# EAGLE design PowerSupply_5V_v1 (EAGLE 9.6.2)

## Sheet 1 of 3: MAIN
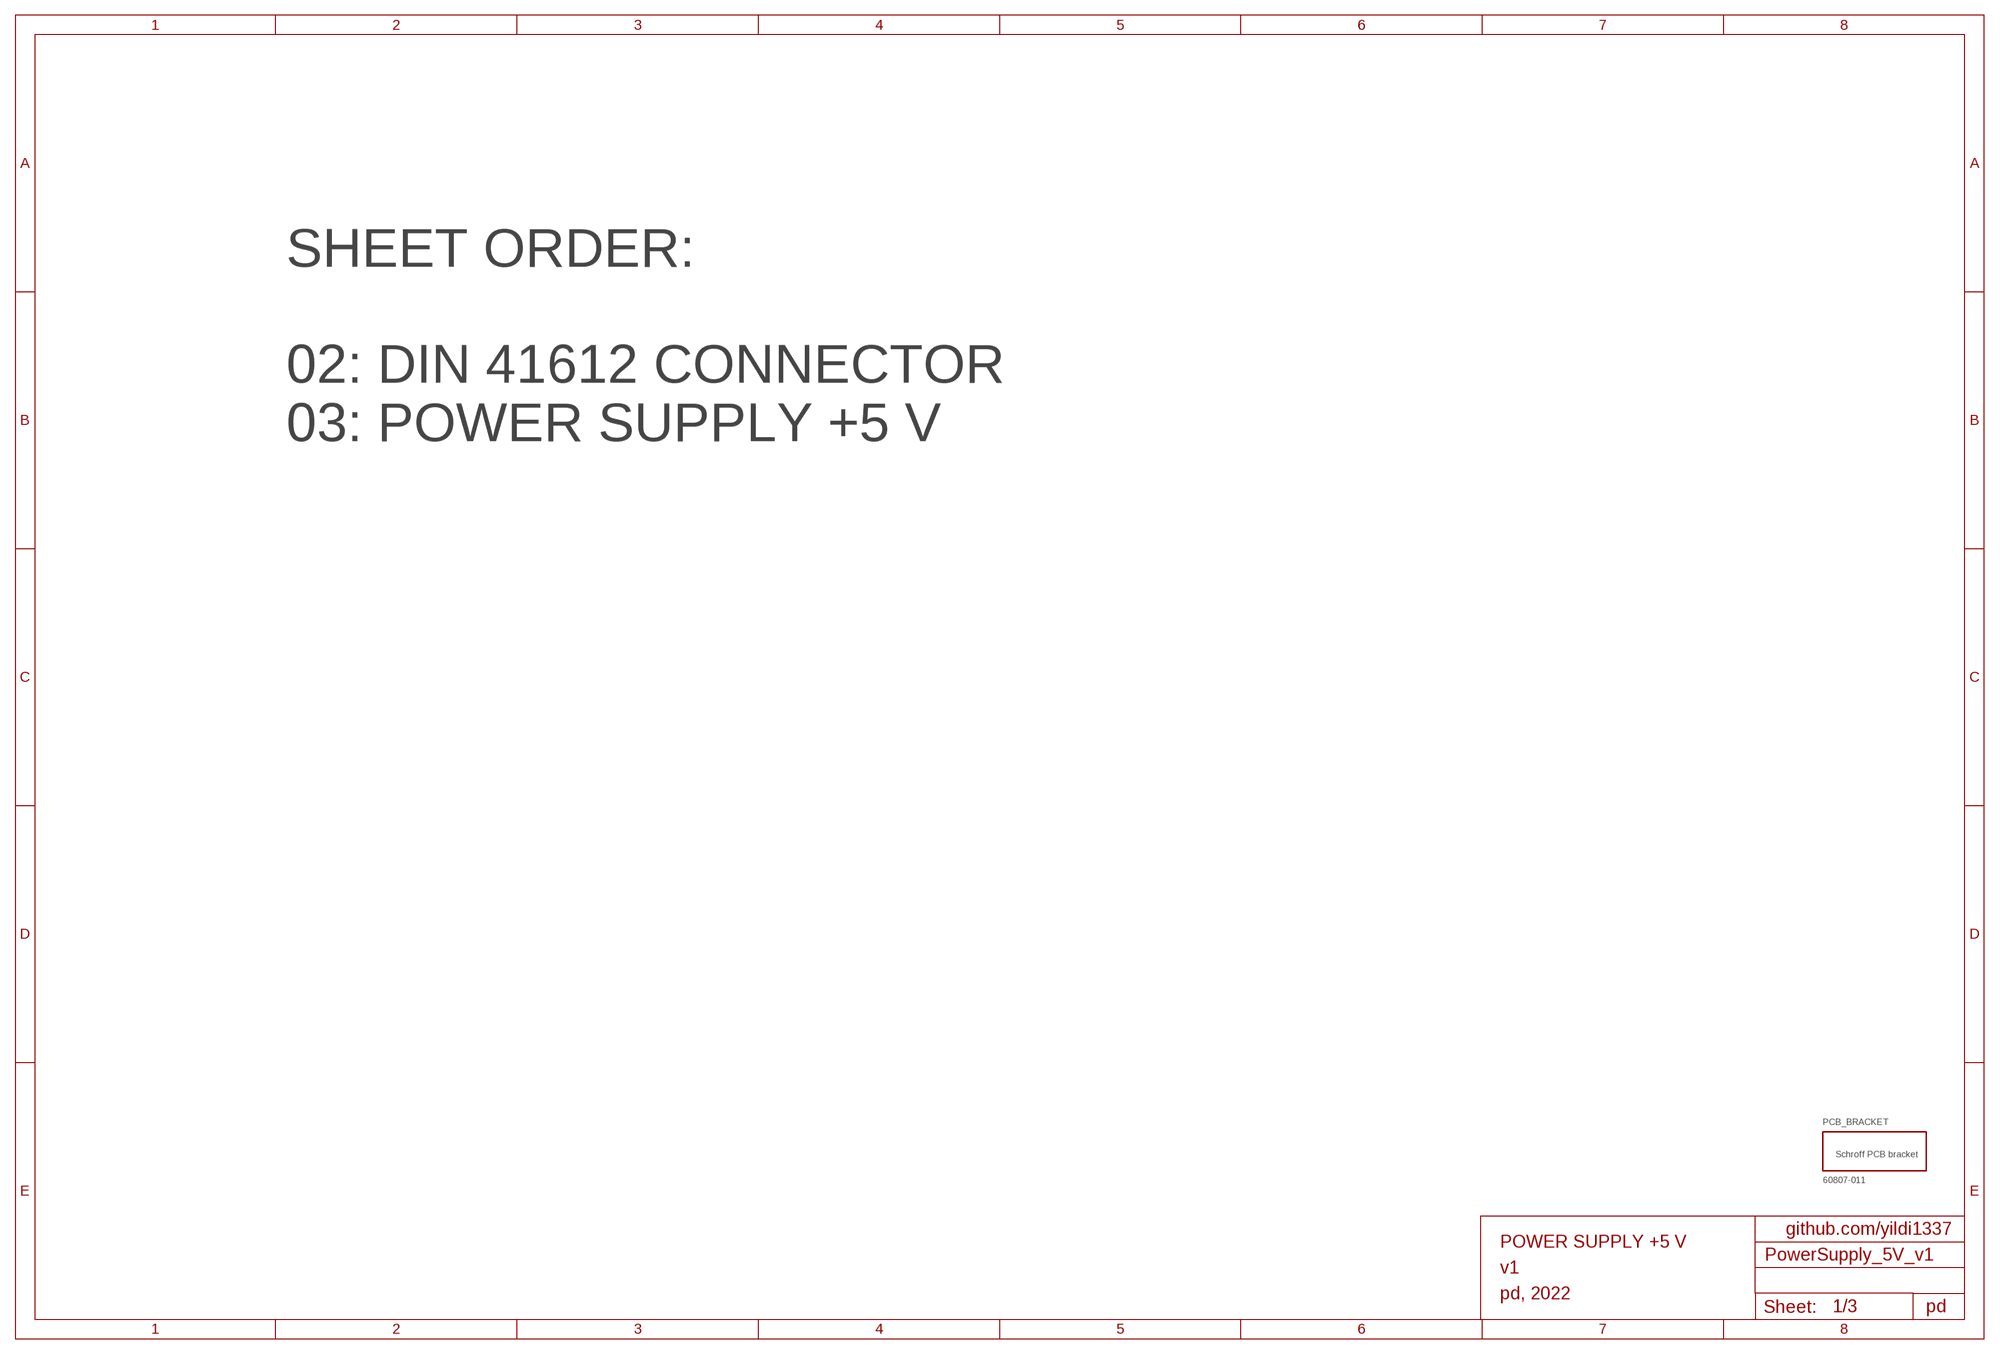
[diagram p0: schematic, sheet 1]

### Parts
PCB_BRACKET  60807-011  [60807-011]

### Notes on the sheet
- SHEET ORDER:
  
  02: DIN 41612 CONNECTOR
  03: POWER SUPPLY +5 V
- github.com/yildi1337
- POWER SUPPLY +5 V
- v1
- pd, 2022
- pd

## Sheet 2 of 3: DIN 41612 CONNECTOR
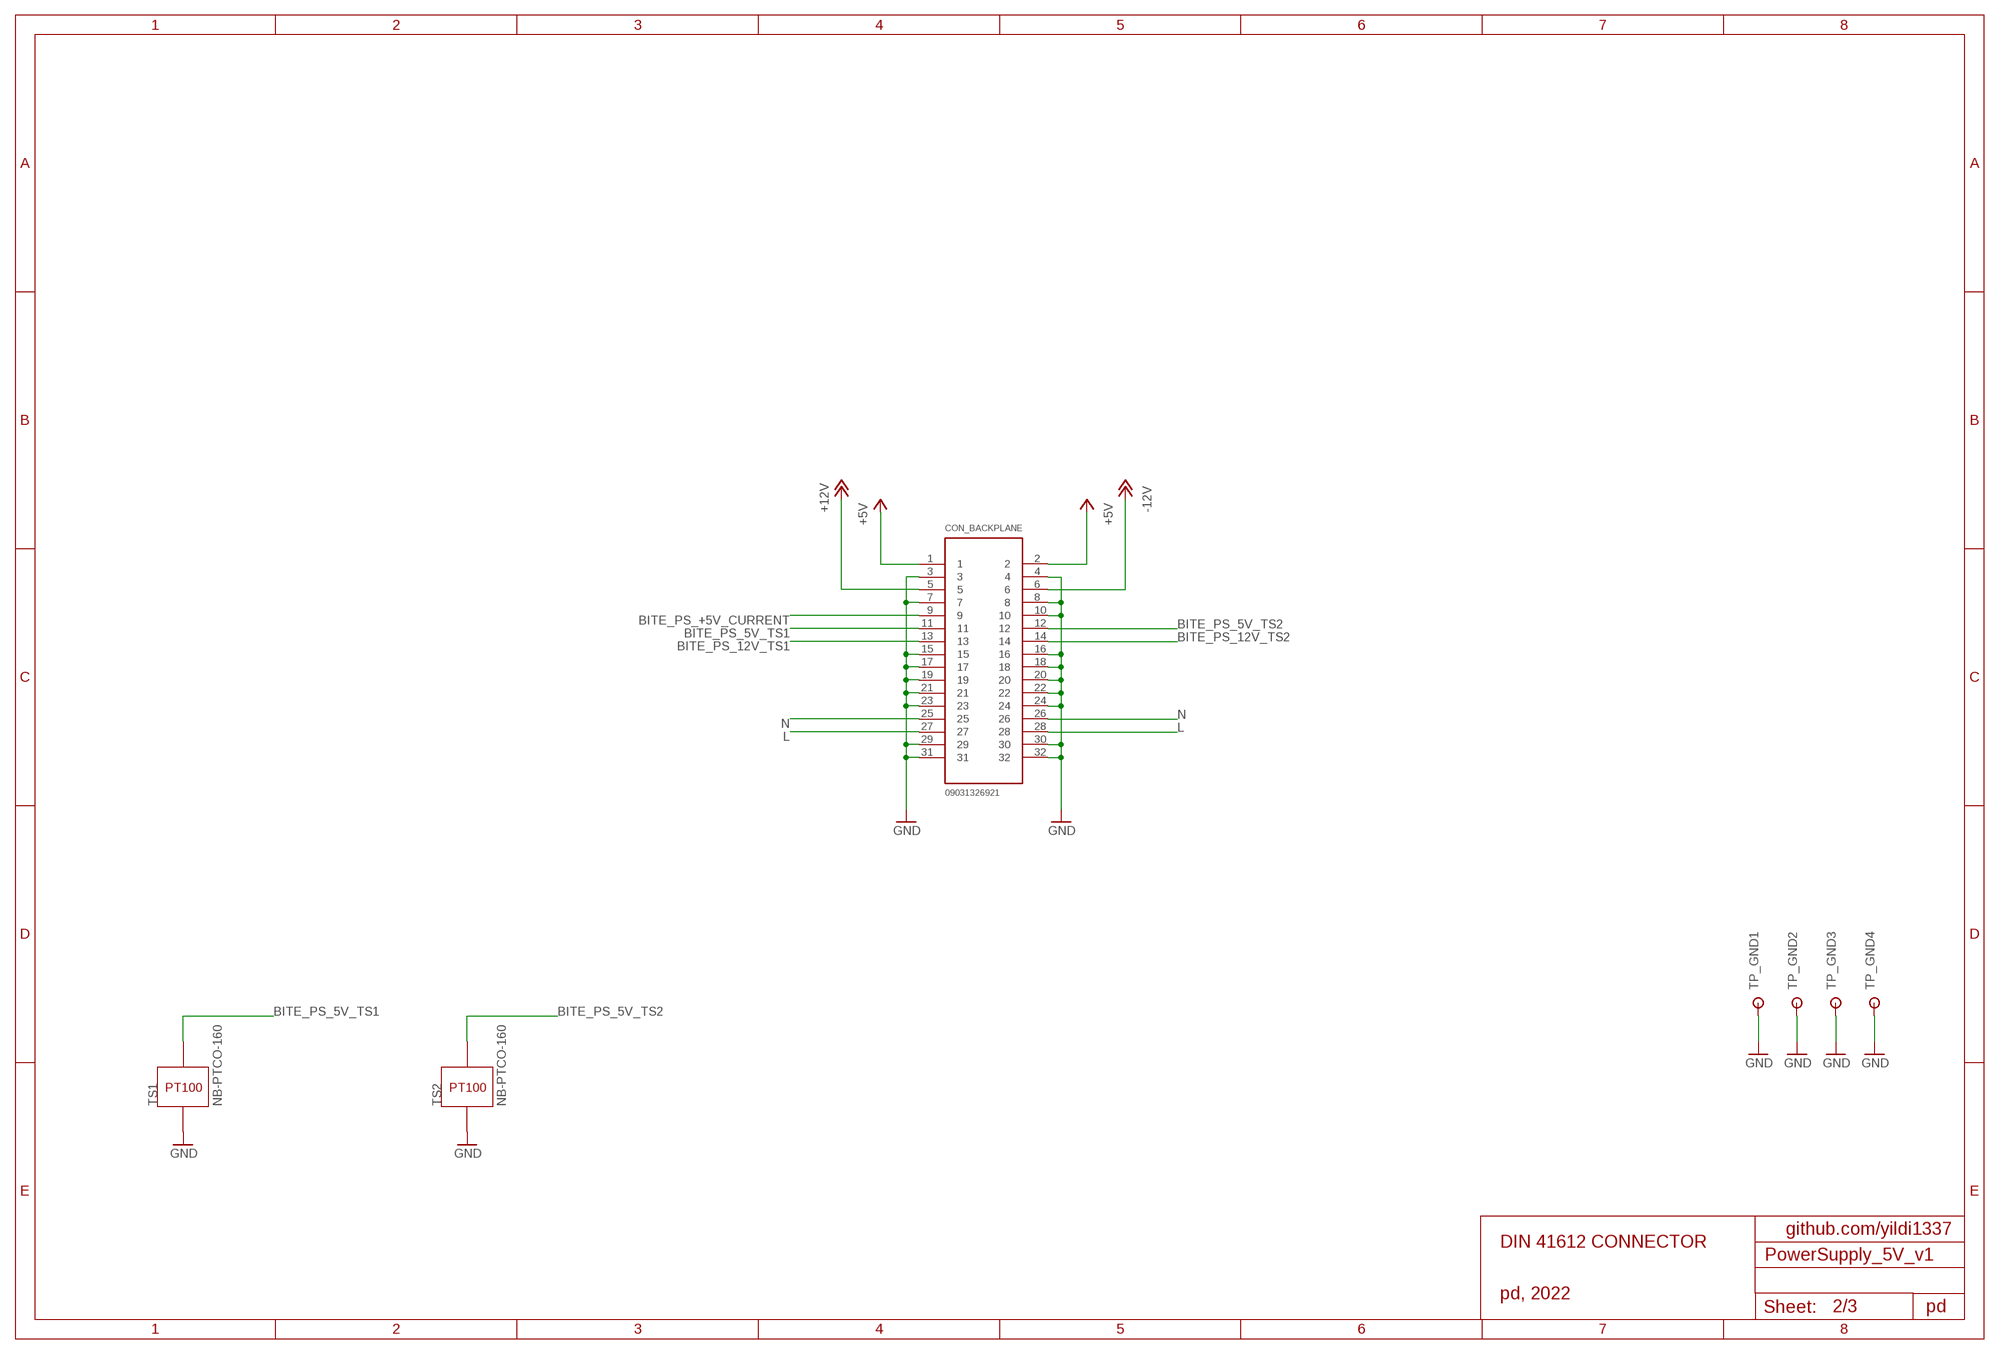
[diagram p1: schematic, sheet 2]

### Parts
CON_BACKPLANE  09031326921  [09031326921]
TP_GND1  RSPRO-1MM-TERMINAL-POST-2622034  [RSPRO-1MM-TERMINAL-POST-2622034]
TP_GND2  RSPRO-1MM-TERMINAL-POST-2622034  [RSPRO-1MM-TERMINAL-POST-2622034]
TP_GND3  RSPRO-1MM-TERMINAL-POST-2622034  [RSPRO-1MM-TERMINAL-POST-2622034]
TP_GND4  RSPRO-1MM-TERMINAL-POST-2622034  [RSPRO-1MM-TERMINAL-POST-2622034]
TS1  NB-PTCO-160  [NB-PTCO-160]
TS2  NB-PTCO-160  [NB-PTCO-160]

### Nets
+5V: CON_BACKPLANE.1 CON_BACKPLANE.2 ; also sheet 3
+12V: CON_BACKPLANE.5
-12V: CON_BACKPLANE.6
BITE_PS_5V_TS1: CON_BACKPLANE.11 TS1.1
BITE_PS_5V_TS2: CON_BACKPLANE.12 TS2.1
BITE_PS_12V_TS1: CON_BACKPLANE.13
BITE_PS_12V_TS2: CON_BACKPLANE.14
BITE_PS_+5V_CURRENT: CON_BACKPLANE.9 ; also sheet 3
GND: CON_BACKPLANE.3 CON_BACKPLANE.4 CON_BACKPLANE.7 CON_BACKPLANE.8 CON_BACKPLANE.10 CON_BACKPLANE.15 CON_BACKPLANE.16 CON_BACKPLANE.17 CON_BACKPLANE.18 CON_BACKPLANE.19 CON_BACKPLANE.20 CON_BACKPLANE.21 CON_BACKPLANE.22 CON_BACKPLANE.23 CON_BACKPLANE.24 CON_BACKPLANE.29 CON_BACKPLANE.30 CON_BACKPLANE.31 CON_BACKPLANE.32 TP_GND1.P$1 TP_GND2.P$1 TP_GND3.P$1 TP_GND4.P$1 TS1.2 TS2.2 ; also sheet 3
L: CON_BACKPLANE.27 CON_BACKPLANE.28 ; also sheet 3
N: CON_BACKPLANE.25 CON_BACKPLANE.26 ; also sheet 3

### Notes on the sheet
- github.com/yildi1337
- DIN 41612 CONNECTOR
- pd, 2022
- pd

## Sheet 3 of 3: POWER SUPPLY +5 V
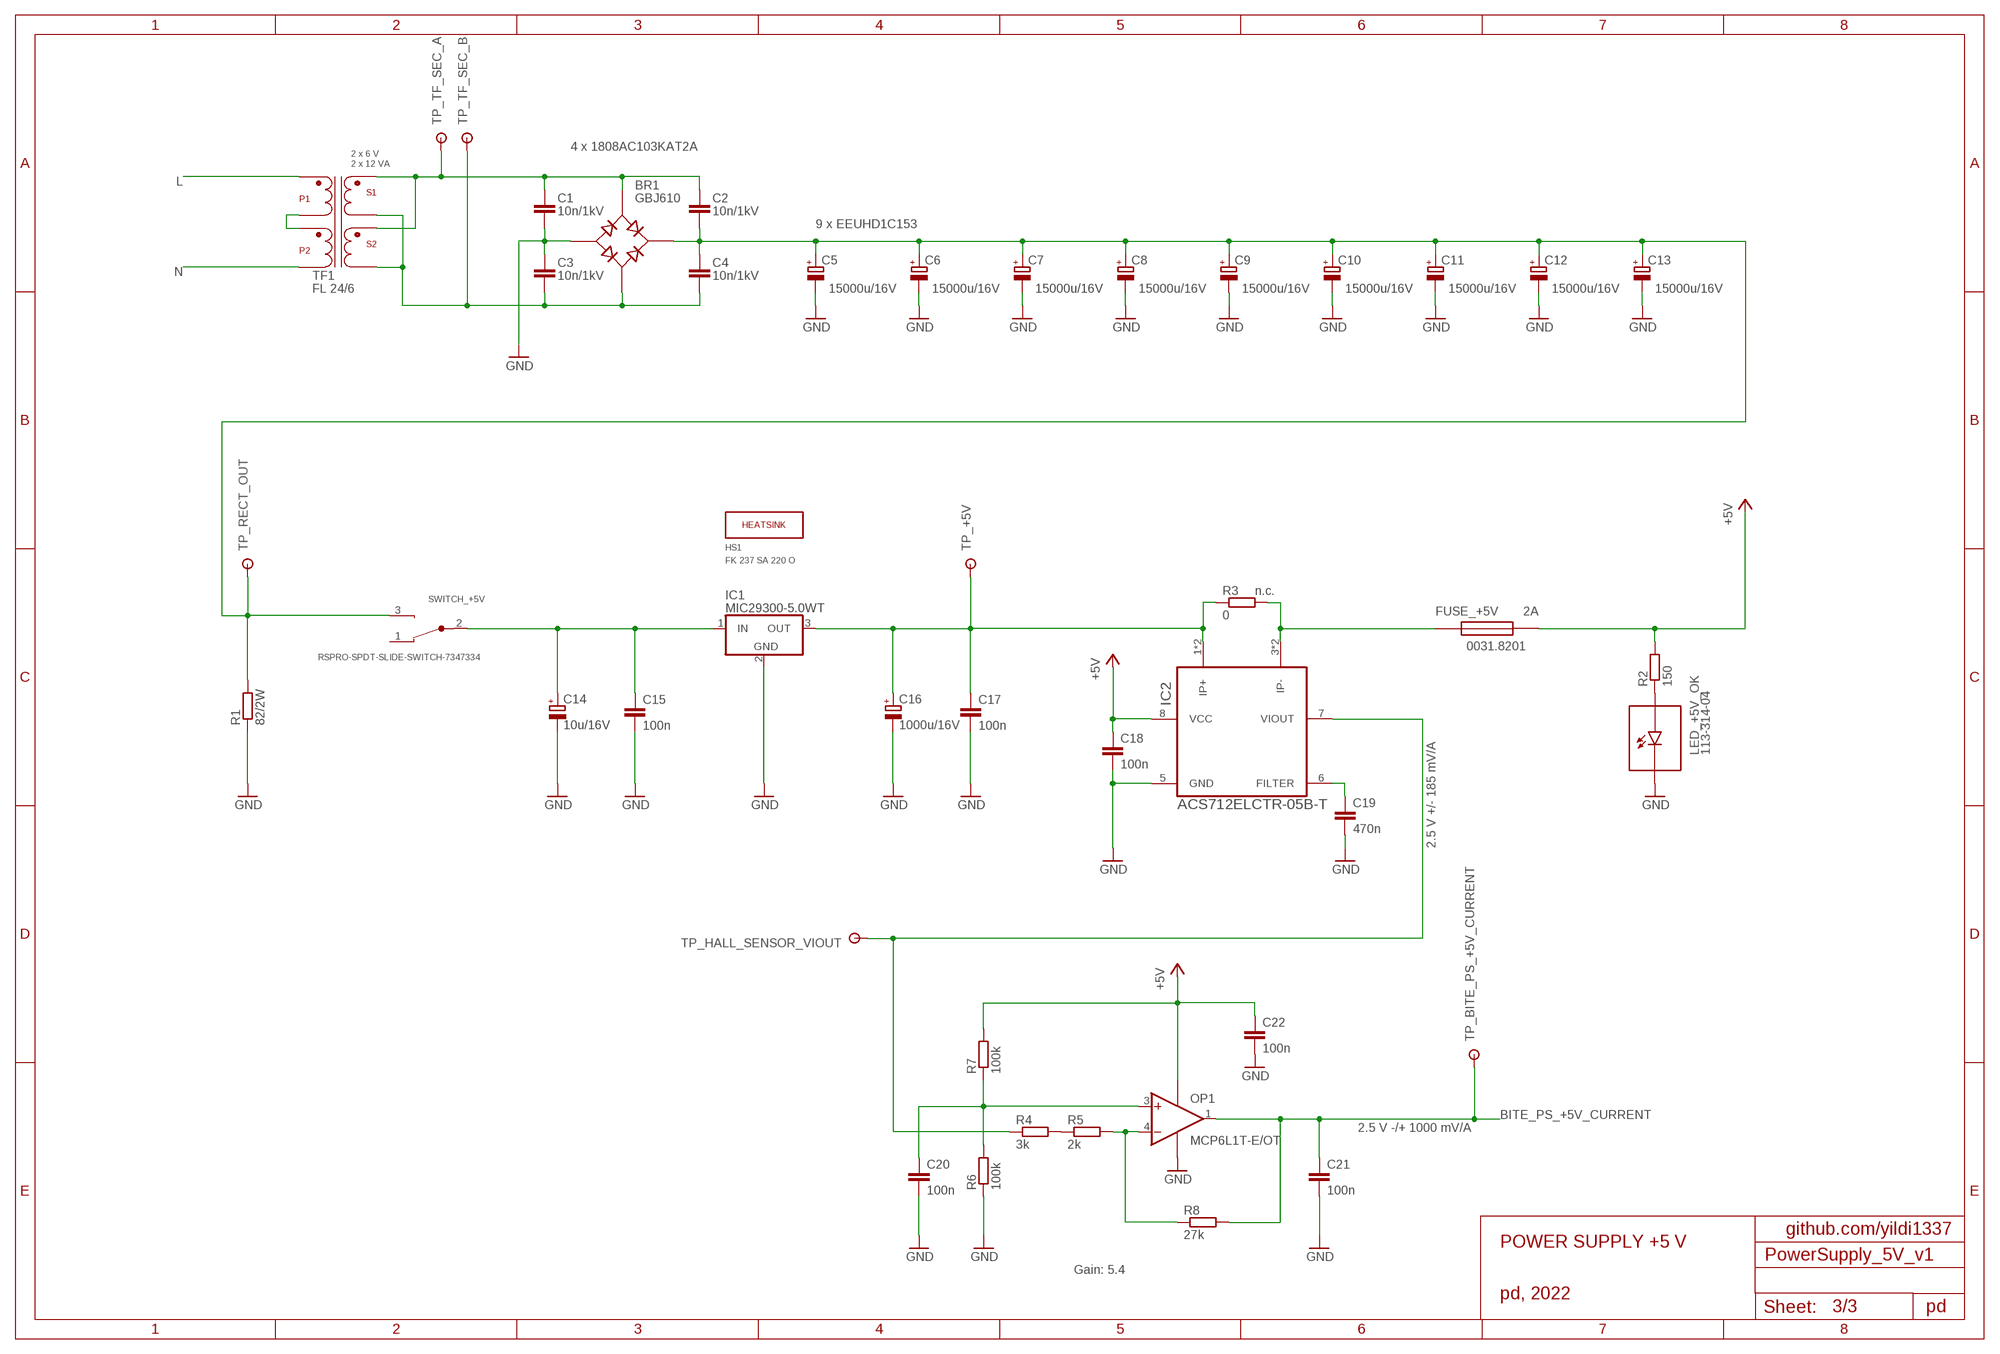
[diagram p2: schematic, sheet 3]

### Parts
BR1  GBJ610  [GBJ610]
C1  10n/1kV  C-EUC1808  [C1808]
C2  10n/1kV  C-EUC1808  [C1808]
C3  10n/1kV  C-EUC1808  [C1808]
C4  10n/1kV  C-EUC1808  [C1808]
C5  15000u/16V  EEUHD1C153  [EEUHD1C153]
C6  15000u/16V  EEUHD1C153  [EEUHD1C153]
C7  15000u/16V  EEUHD1C153  [EEUHD1C153]
C8  15000u/16V  EEUHD1C153  [EEUHD1C153]
C9  15000u/16V  EEUHD1C153  [EEUHD1C153]
C10  15000u/16V  EEUHD1C153  [EEUHD1C153]
C11  15000u/16V  EEUHD1C153  [EEUHD1C153]
C12  15000u/16V  EEUHD1C153  [EEUHD1C153]
C13  15000u/16V  EEUHD1C153  [EEUHD1C153]
C14  10u/16V  CPOL-EU153CLV-0405  [153CLV-0405]
C15  100n  C-EUC0603  [C0603]
C16  1000u/16V  CPOL-EU153CLV-1010  [153CLV-1010]
C17  100n  C-EUC0603  [C0603]
C18  100n  C-EUC0603  [C0603]
C19  470n  C-EUC0603  [C0603]
C20  100n  C-EUC0603  [C0603]
C21  100n  C-EUC0603  [C0603]
C22  100n  C-EUC0603  [C0603]
FUSE_+5V  0031.8201  [0031.8201]
HS1  FK 237 SA 220 O  FK_237_SA_220_O  [FK_237_SA_220_O]
IC1  MIC29300-5.0WT  [MIC29300-5.0WT]
IC2  ACS712ELCTR-05B-T  [ACS712ELCTR-05B-T]
LED_+5V_OK  113-314-04  [113-314-04]
OP1  MCP6L1T-E/OT  [MCP6L1T-E/OT]
R1  82/2W  R-EU_R2010  [R2010]
R2  150  R-EU_R0603  [R0603]
R3  0  R-EU_R0603  [R0603]
R4  3k  R-EU_R0603  [R0603]
R5  2k  R-EU_R0603  [R0603]
R6  100k  R-EU_R0603  [R0603]
R7  100k  R-EU_R0603  [R0603]
R8  27k  R-EU_R0603  [R0603]
SWITCH_+5V  RSPRO-SPDT-SLIDE-SWITCH-7347334  [RSPRO-SPDT-SLIDE-SWITCH-7347334]
TF1  FL 24/6  FL_24-6  [FL_24-6]
TP_+5V  RSPRO-1MM-TERMINAL-POST-2622034  [RSPRO-1MM-TERMINAL-POST-2622034]
TP_BITE_PS_+5V_CURRENT  RSPRO-1MM-TERMINAL-POST-2622034  [RSPRO-1MM-TERMINAL-POST-2622034]
TP_HALL_SENSOR_VIOUT  RSPRO-1MM-TERMINAL-POST-2622034  [RSPRO-1MM-TERMINAL-POST-2622034]
TP_RECT_OUT  RSPRO-1MM-TERMINAL-POST-2622034  [RSPRO-1MM-TERMINAL-POST-2622034]
TP_TF_SEC_A  RSPRO-1MM-TERMINAL-POST-2622034  [RSPRO-1MM-TERMINAL-POST-2622034]
TP_TF_SEC_B  RSPRO-1MM-TERMINAL-POST-2622034  [RSPRO-1MM-TERMINAL-POST-2622034]

### Nets
+5V: C18.1 C22.1 FUSE_+5V.2 IC2.8(VCC) OP1.2(VDD) R2.2 R7.2 ; also sheet 2
BITE_PS_+5V_CURRENT: C21.1 OP1.1(VOUT) R8.2 TP_BITE_PS_+5V_CURRENT.P$1 ; also sheet 2
GND: BR1.- C1.2 C3.1 C5.- C6.- C7.- C8.- C9.- C10.- C11.- C12.- C13.- C14.- C15.2 C16.- C17.2 C18.2 C19.2 C20.2 C21.2 C22.2 IC1.2(GND) IC2.5(GND) LED_+5V_OK.-(C) OP1.5(VSS) R1.1 R6.1 ; also sheet 2
L: TF1.P1A ; also sheet 2
N: TF1.P2B ; also sheet 2
N$1: C19.1 IC2.6(FILTER)
N$2: FUSE_+5V.1 IC2.3(IP-) IC2.4(IP-) R3.2
N$3: BR1.+ C2.2 C4.1 C5.+ C6.+ C7.+ C8.+ C9.+ C10.+ C11.+ C12.+ C13.+ R1.2 SWITCH_+5V.3(NO) TP_RECT_OUT.P$1
N$4: IC2.7(VIOUT) R4.1 TP_HALL_SENSOR_VIOUT.P$1
N$5: TF1.P1B TF1.P2A
N$6: BR1.L C1.1 C2.1 TF1.S1A TF1.S2A TP_TF_SEC_A.P$1
N$7: LED_+5V_OK.+(A) R2.1
N$8: C16.+ C17.1 IC1.3(OUT) IC2.1(IP+) IC2.2(IP+) R3.1 TP_+5V.P$1
N$9: R4.2 R5.1
N$10: BR1.N C3.2 C4.2 TF1.S1B TF1.S2B TP_TF_SEC_B.P$1
N$11: C20.1 OP1.3(VIN+) R6.2 R7.1
N$12: C14.+ C15.1 IC1.1(IN) SWITCH_+5V.2(COM)
N$13: OP1.4(VIN-) R5.2 R8.1
Unconnected: SWITCH_+5V.1(NC)

### Notes on the sheet
- 4 x 1808AC103KAT2A
- 9 x EEUHD1C153
- n.c.
- 2A
- 2.5 V +/- 185 mV/A
- 2.5 V -/+ 1000 mV/A
- github.com/yildi1337
- POWER SUPPLY +5 V
- Gain: 5.4
- pd, 2022
- pd

## Library data of the parts
BR1 = GBJ610:GBJ610
C1-C4 C15 C17-C22 = rcl:C-EU: CAPACITOR, European symbol; SPICEPREFIX: C
C5-C13 = EEUHD1C153:EEUHD1C153
C14 C16 = rcl:CPOL-EU: POLARIZED CAPACITOR, European symbol; SPICEPREFIX: C
CON_BACKPLANE = 09031326921:09031326921
FUSE_+5V = 0031.8201:0031.8201
HS1 = FK_237_SA_220_O:FK_237_SA_220_O
IC1 = MIC29300-5.0WT:MIC29300-5.0WT
IC2 = ACS712ELCTR-05B-T:ACS712ELCTR-05B-T
LED_+5V_OK = 113-314-04:113-314-04
OP1 = MCP6L1T-E-OT:MCP6L1T-E/OT
PCB_BRACKET = 60807-011:60807-011
R1-R8 = rcl:R-EU_: RESISTOR, European symbol; SPICEPREFIX: R
SWITCH_+5V = RSPRO-SPDT-SLIDE-SWITCH-7347334:RSPRO-SPDT-SLIDE-SWITCH-7347334
TF1 = FL_24-6:FL_24-6
TP_+5V TP_BITE_PS_+5V_CURRENT TP_GND1-TP_GND4 TP_HALL_SENSOR_VIOUT TP_RECT_OUT TP_TF_SEC_A TP_TF_SEC_B = RSPRO-1MM-TERMINAL-POST-2622034:RSPRO-1MM-TERMINAL-POST-2622034
TS1 TS2 = NB-PTCO-160:NB-PTCO-160

## Board
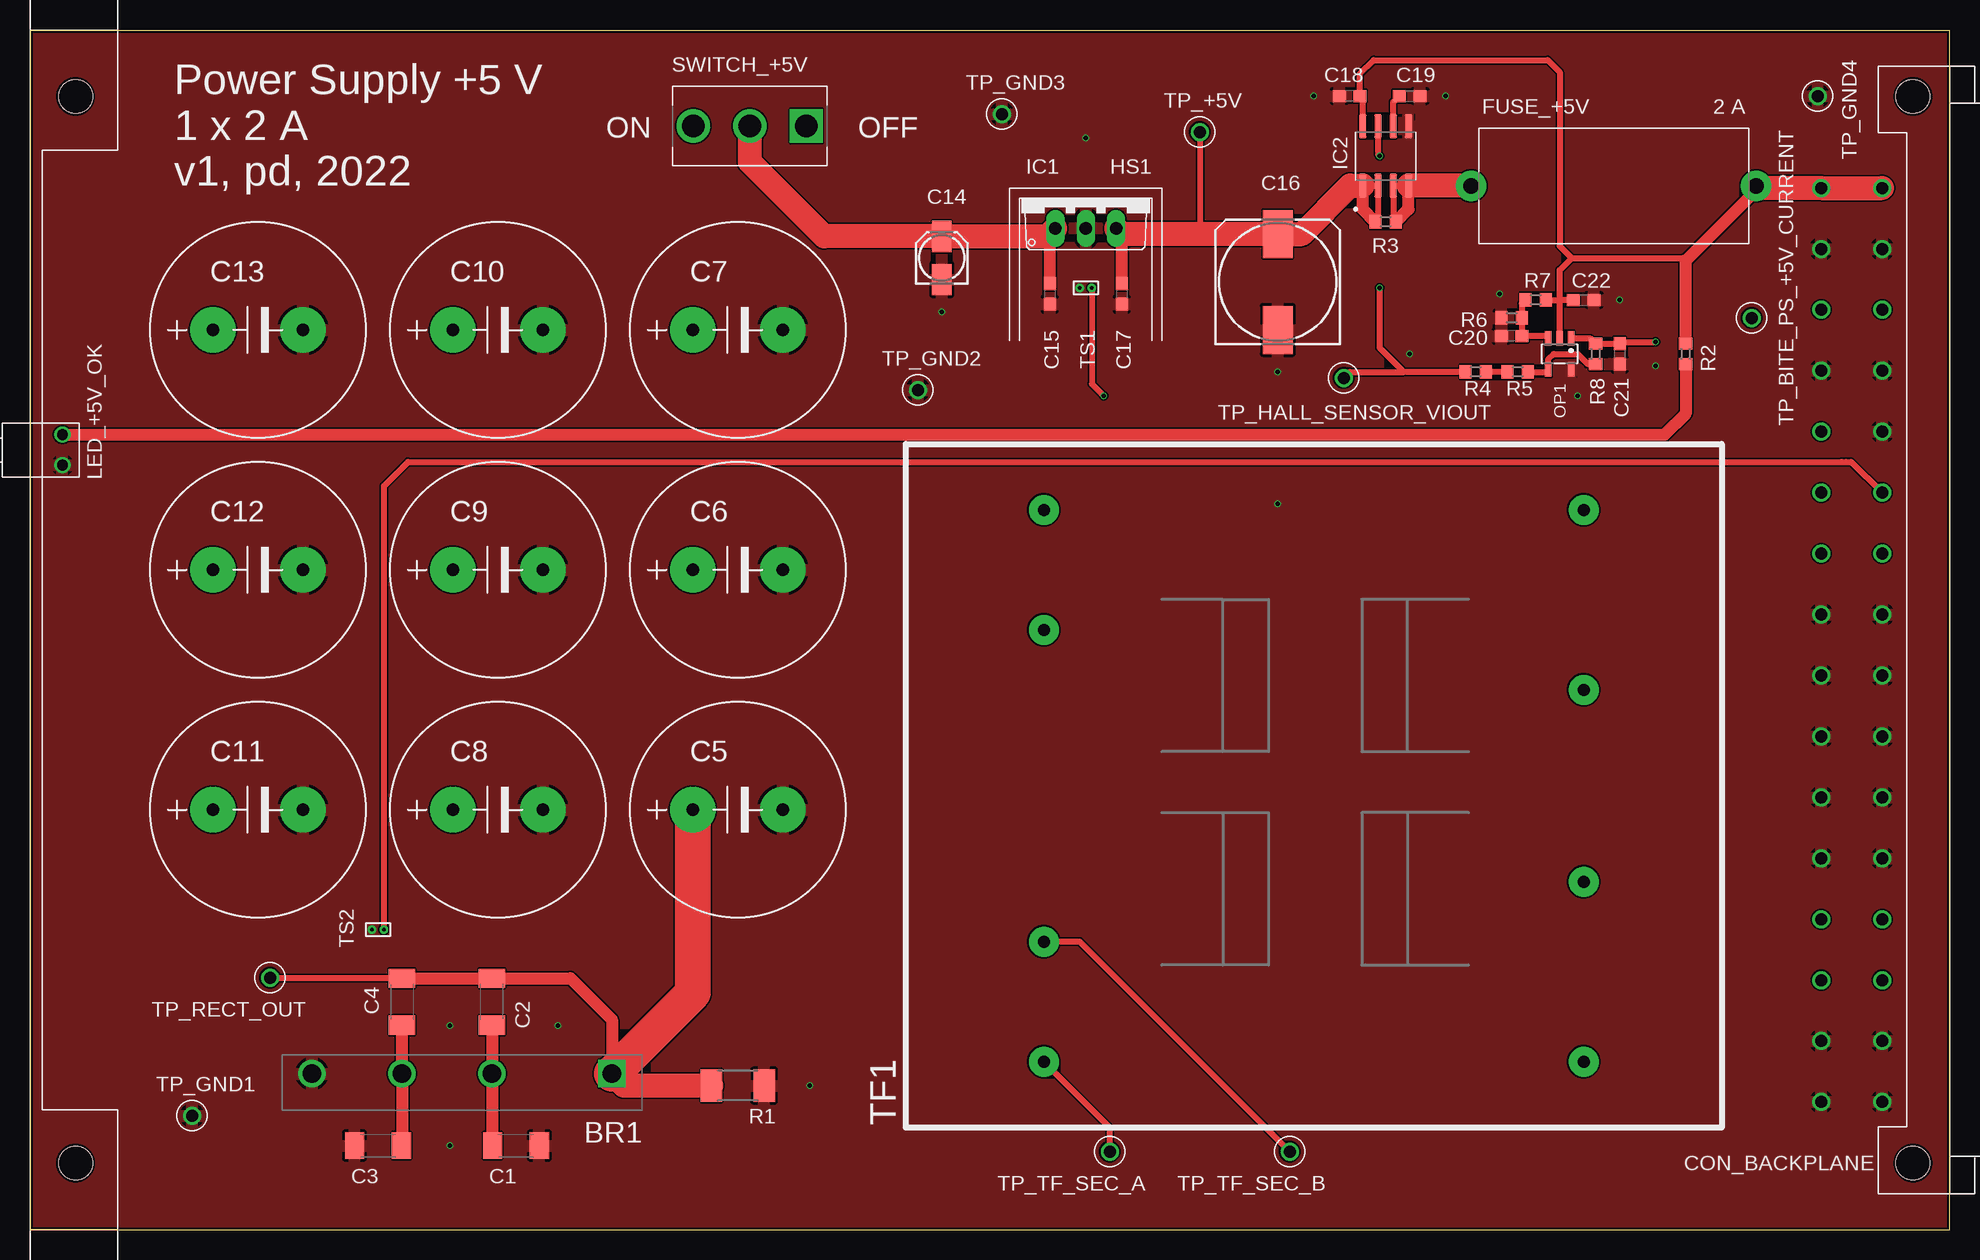
[diagram p3: board, top side]
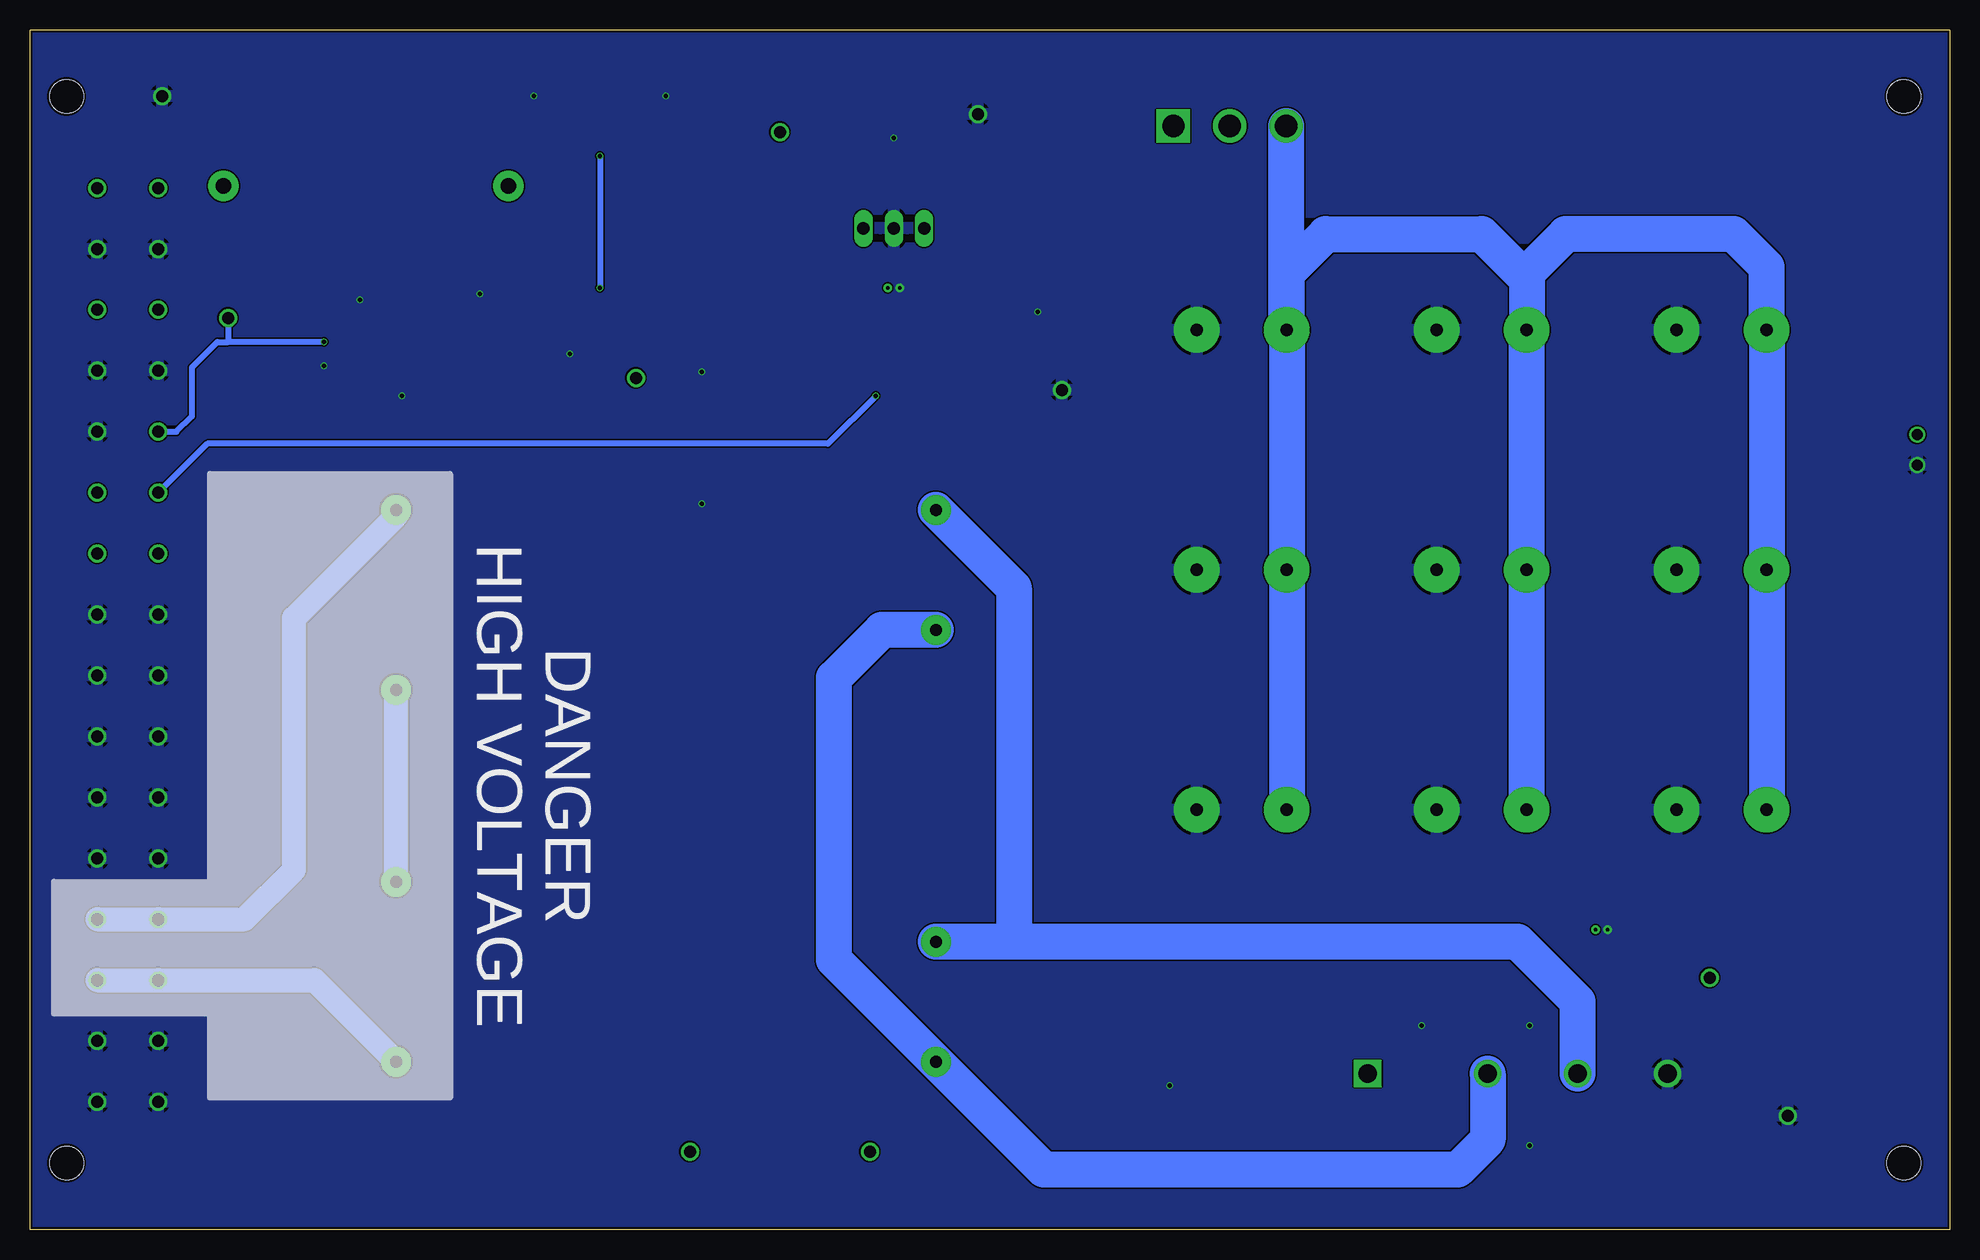
[diagram p4: board, bottom side, seen from below]

Size 160 x 100 mm. Coordinates in mm from the lower left corner, seen from the top.
Outline: 0,0 160,0 160,100 0,100 0,0
Copper layers (1*16): Top 0.035559375mm / dielectric 1.6mm / Bottom 0.035559375mm
Design rules "jlcpcb2layer": minimum track width 5mil, minimum drill 12mil, track to track 5mil, track to pad 5mil, pad to pad 5mil, via to via 5mil, smd to smd 5mil, copper to edge 8mil, drill to drill 6mil, minimum pad ring 5mil, minimum via ring 3mil, stop-mask expansion 2.5mil, vias tented up to drill 0mil, thermal gap 10mil

### Footprints (pad centres in the part's own frame; a part is rotated, then mirrored left to right if it is on the bottom)
GBJ610 = drill 1.51 pad 2.27 square: + -12.5,0 | drill 1.51 pad 2.27: - 12.5,0; L -2.5,0; N 5,0
C1808 = smd 1.6 x 2.2: 1 -1.95,0; 2 1.95,0
EEUHD1C153 = drill 1.016 pad 3.81: + -3.75,0; - 3.75,0
153CLV-0405 = smd 2.6 x 1.6: + 1.8,0; - -1.8,0
C0603 = smd 1.1 x 1: 1 -0.85,0; 2 0.85,0
153CLV-1010 = smd 4 x 2.5: + 4,0; - -4,0
09031326921 = drill 1: 1 36.83,10.7; 2 36.83,5.62; 3 31.75,10.7; 4 31.75,5.62; 5 26.67,10.7; 6 26.67,5.62; 7 21.59,10.7; 8 21.59,5.62; 9 16.51,10.7; 10 16.51,5.62; 11 11.43,10.7; 12 11.43,5.62; 13 6.35,10.7; 14 6.35,5.62; 15 1.27,10.7; 16 1.27,5.62; 17 -3.81,10.7; 18 -3.81,5.62; 19 -8.89,10.7; 20 -8.89,5.62; 21 -13.97,10.7; 22 -13.97,5.62; 23 -19.05,10.7; 24 -19.05,5.62; 25 -24.13,10.7; 26 -24.13,5.62; 27 -29.21,10.7; 28 -29.21,5.62; 29 -34.29,10.7; 30 -34.29,5.62; 31 -39.37,10.7; 32 -39.37,5.62 | hole 2.8: -44.45,3.05; 44.45,3.05
0031.8201 = drill 1.3 pad 2.54: 1 -11.875,0; 2 11.875,0
MIC29300-5.0WT = drill 1.016 long: 1 -2.54,-2.54; 2 0,-2.54; 3 2.54,-2.54
ACS712ELCTR-05B-T = smd 1.97 x 0.6: 1 -2.475,1.905; 2 -2.475,0.635; 3 -2.475,-0.635; 4 -2.475,-1.905; 5 2.475,-1.905; 6 2.475,-0.635; 7 2.475,0.635; 8 2.475,1.905
113-314-04 = drill 0.9: + -1.27,0; - 1.27,0
MCP6L1T-E/OT = smd 0.55 x 1.2: 1 -0.95,-1.3; 2 0,-1.3; 3 0.95,-1.3; 4 0.95,1.3; 5 -0.95,1.3
60807-011 = hole 2.8: 0,44.45; 0,-44.45
R2010 = smd 1.8 x 2.7: 1 -2.2,0; 2 2.2,0
R0603 = smd 1 x 1.1: 1 -0.85,0; 2 0.85,0
RSPRO-SPDT-SLIDE-SWITCH-7347334 = drill 1.85 square: 1 -4.7,0 | drill 1.85: 2 0,0; 3 4.7,0
FL_24-6 = drill 1 pad 2.5: P1A -22.5,23; P1B -22.5,8; P2A -22.5,-8; P2B -22.5,-23; S1A 22.5,23; S1B 22.5,13; S2A 22.5,-13; S2B 22.5,-23
RSPRO-1MM-TERMINAL-POST-2622034 = drill 1: P$1 0,0
NB-PTCO-160 = drill 0.275 pad 0.711: 1 -0.5,0; 2 0.5,0

### Placement (x,y rotation side)
BR1  36,13 180 top
C1  40.5,7 0 top
C2  38.5,19 90 top
C3  29,7 0 top
C4  31,19 270 top
C5  59,35 0 top
C6  59,55 0 top
C7  59,75 0 top
C8  39,35 0 top
C9  39,55 0 top
C10  39,75 0 top
C11  19,35 0 top
C12  19,55 0 top
C13  19,75 0 top
C14  76,81 90 top
C15  85,78 270 top
C16  104,79 90 top
C17  91,78 270 top
C18  110,94.5 180 top
C19  115,94.5 0 top
C20  123.5,74.5 180 top
C21  132.5,73 270 top
C22  129.5,77.5 0 top
CON_BACKPLANE  160,50 90 top
FUSE_+5V  132,87 0 top
HS1  88,86 0 top
IC1  88,86 0 top
IC2  113,89.5 90 top
LED_+5V_OK  2.7,65 270 top
OP1  127.5,73 180 top
PCB_BRACKET  3.8,50 0 top
R1  59,12 180 top
R2  138,73 90 top
R3  113,84 0 top
R4  120.5,71.5 0 top
R5  124,71.5 0 top
R6  123.5,76 0 top
R7  125.5,77.5 0 top
R8  130.5,73 90 top
SWITCH_+5V  60,92 180 top
TF1  107,37 180 top
TP_+5V  97.5,91.5 0 top
TP_BITE_PS_+5V_CURRENT  143.5,76 0 top
TP_GND1  13.5,9.5 0 top
TP_GND2  74,70 0 top
TP_GND3  81,93 0 top
TP_GND4  149,94.5 270 top
TP_HALL_SENSOR_VIOUT  109.5,71 0 top
TP_RECT_OUT  20,21 180 top
TP_TF_SEC_A  90,6.5 180 top
TP_TF_SEC_B  105,6.5 180 top
TS1  88,78.5 180 top
TS2  29,25 180 top

### Tracks (layer width: path | path; a pad name or v marks a point on that pad's centre or on a via)
+5V
  Top 0.5: IC2.8 111.09,94.25 C18.1 110.85,96.35 112,97.5 126.5,97.5 127.5,96.5 127.5,82 128.5,81 | R7.2 127.5,77.5 | OP1.2 127.5,77.5 | 127.5,77.5 127.5,80 128.5,81 | 128.5,81 137.78,81 138,80.78 | C22.1 127.5,77.5
  Top 1: R2.2 138,80.78 144.04,86.83
  Top 2: CON_BACKPLANE.2 CON_BACKPLANE.1 144.04,86.83 FUSE_+5V.2
BITE_PS_5V_TS1  (via drill 0.35)
  Top 0.5: TS1.1 88.5,70.5 v89.5,69.5
  Bottom 0.5: v89.5,69.5 93.49,65.51 145.22,65.51 CON_BACKPLANE.11
BITE_PS_5V_TS2
  Top 0.5: TS2.1 29.5,62 31.5,64 151,64 151.37,64 151.81,64 CON_BACKPLANE.12
BITE_PS_+5V_CURRENT  (via drill 0.35)
  Top 0.5: OP1.1 130.05,74.3 R8.2 C21.1 132.65,74 v135.5,74
  Bottom 0.5: v135.5,74 143.5,74 | 143.5,74 144.39,74 146.5,71.89 146.5,67.81 147.8,66.51 CON_BACKPLANE.9 | TP_BITE_PS_+5V_CURRENT.P$1 143.5,74
GND  (via drill 0.35)
  other vias: 104,71.5 88,91 35,17 35,7 44,17 65,12 76,76.5 118,94.5 107,94.5 104,60.5 129,69.5 135.5,72 122.5,78 132.5,77.5 115,73
  pour Top: 0,0 0,100 160,100 160,0
  pour Bottom: 0,0 0,100 160,100 160,0
L
  Bottom 2: CON_BACKPLANE.28 CON_BACKPLANE.27 136.29,20.79 TF1.P1A
N
  Bottom 2: CON_BACKPLANE.26 CON_BACKPLANE.25 142.13,25.87 138,30 138,51 129.5,59.5 TF1.P2B
N$1
  Top 0.5: IC2.6 113.64,93.98 C19.1
N$2
  Top 0.5: R3.2 113.64,84.22 IC2.3 IC2.4
  Top 1: R3.2 114.91,85.06 IC2.4
  Top 2: FUSE_+5V.1 120.1,87.03 IC2.4
N$3
  Top 0.5: TP_RECT_OUT.P$1 31.45,21 31.5,20.95
  Top 1: C4.1 31.5,20.95 C2.2 45.05,20.95 48.5,17.5 BR1.+
  Top 2: R1.2 49.5,12 BR1.+
  Top 3: BR1.+ 55.25,19.75 C5.+
  Bottom 3: C7.+ C6.+ C5.+ | C8.+ C9.+ C10.+ | C11.+ C12.+ C13.+ 15.25,80.25 18,83 32,83 35.25,79.75 C10.+ | C7.+ 55.25,79.75 52,83 39,83 35.25,79.25 C10.+ | SWITCH_+5V.3 55.3,75.05 C7.+
N$4  (via drill 0.35)
  Top 0.5: IC2.7 112.36,89.64 v112.5,89.5 | 114.5,71.5 112.5,73.5 v112.5,78.5 | TP_HALL_SENSOR_VIOUT.P$1 110,71.5 114.5,71.5 | R4.1 114.5,71.5
  Bottom 0.5: v112.5,89.5 v112.5,78.5
N$5
  Bottom 2: TF1.P1B TF1.P2A
N$6
  Top 0.5: TP_TF_SEC_A.P$1 90,8.5 TF1.S1A
  Top 1: C2.1 BR1.L 38.5,7.05 C1.1
  Bottom 3: BR1.L 38.5,7.5 41,5 75.5,5 TF1.S1A 93,22.5 93,46 89,50 TF1.S2A
N$7
  Top 1: LED_+5V_OK.+ 136.27,66.27 138,68 R2.1
N$8
  Top 0.5: R3.1 112.36,84.22 IC2.2 IC2.1 | TP_+5V.P$1 97.5,83
  Top 1: C17.1 91,83 | R3.1 111.09,85.06 IC2.1
  Top 2: IC1.3 91,83 97.5,83 C16.+ 106,83 110.03,87.03 IC2.1
N$9
  Top 0.5: R5.1 R4.2
N$10
  Top 0.5: TP_TF_SEC_B.P$1 87.5,24 TF1.S1B
  Top 1: C3.2 31,7.05 BR1.N C4.2
  Bottom 3: BR1.N 31,19 36,24 78,24 | 78,24 TF1.S1B | TF1.S2B 78,53.5 78,24
N$11
  Top 0.5: OP1.3 126.35,74.5 C20.1 R6.2 124.35,77.2 R7.1
N$12
  Top 1: C15.1 85,83 IC1.1
  Top 2: IC1.1 84.8,82.8 C14.+ 66.2,82.8 60,89 SWITCH_+5V.2
N$13
  Top 0.5: R8.1 129.85,72.15 129,73 127,73 126.55,72.55 OP1.4 126.35,71.5 R5.2

### Text on the board
tPlace: 2 A | Power Supply +5 V / 1 x 2 A / v1, pd, 2022
bPlace: DANGER / HIGH VOLTAGE
tNames: ON | OFF